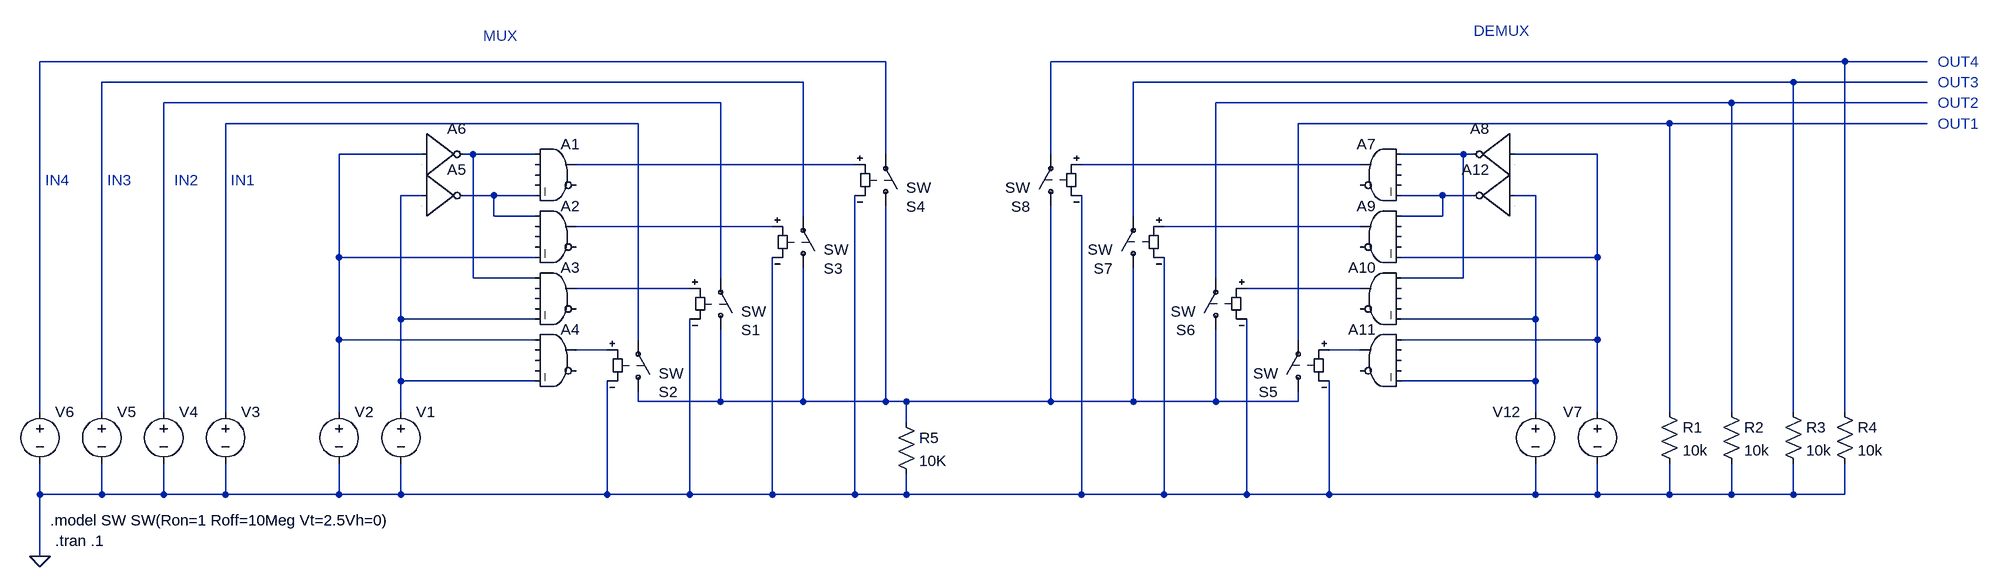
[diagram p0: schematic Mux-demux2.asc]
Mux-demux2.asc, the LTspice schematic file:
Version 4
SHEET 1 1648 1716
WIRE -224 768 -1536 768
WIRE 1264 768 32 768
WIRE 1392 768 1264 768
WIRE -352 800 -1440 800
WIRE 1184 800 160 800
WIRE 1392 800 1184 800
WIRE -480 832 -1344 832
WIRE 1088 832 288 832
WIRE 1392 832 1088 832
WIRE -608 864 -1248 864
WIRE 992 864 416 864
WIRE 1392 864 992 864
WIRE -944 912 -1072 912
WIRE -864 912 -880 912
WIRE -768 912 -864 912
WIRE -224 912 -224 768
WIRE 32 912 32 768
WIRE 672 912 576 912
WIRE 688 912 672 912
WIRE 880 912 752 912
WIRE -272 928 -704 928
WIRE 512 928 80 928
WIRE -944 976 -976 976
WIRE -832 976 -880 976
WIRE -768 976 -832 976
WIRE 640 976 576 976
WIRE 688 976 640 976
WIRE 784 976 752 976
WIRE -832 1008 -832 976
WIRE -768 1008 -832 1008
WIRE -352 1008 -352 800
WIRE 160 1008 160 800
WIRE 640 1008 640 976
WIRE 640 1008 576 1008
WIRE -400 1024 -704 1024
WIRE 512 1024 208 1024
WIRE -1072 1072 -1072 912
WIRE -768 1072 -1072 1072
WIRE 880 1072 880 912
WIRE 880 1072 576 1072
WIRE -864 1104 -864 912
WIRE -768 1104 -864 1104
WIRE -480 1104 -480 832
WIRE 288 1104 288 832
WIRE 672 1104 672 912
WIRE 672 1104 576 1104
WIRE -528 1120 -704 1120
WIRE 512 1120 336 1120
WIRE -976 1168 -976 976
WIRE -768 1168 -976 1168
WIRE 784 1168 784 976
WIRE 784 1168 576 1168
WIRE -1072 1200 -1072 1072
WIRE -768 1200 -1072 1200
WIRE -608 1200 -608 864
WIRE 416 1200 416 864
WIRE 880 1200 880 1072
WIRE 880 1200 576 1200
WIRE -656 1216 -704 1216
WIRE 512 1216 464 1216
WIRE -976 1264 -976 1168
WIRE -768 1264 -976 1264
WIRE 784 1264 784 1168
WIRE 784 1264 576 1264
WIRE -608 1296 -608 1280
WIRE -480 1296 -480 1184
WIRE -480 1296 -608 1296
WIRE -352 1296 -352 1088
WIRE -352 1296 -480 1296
WIRE -224 1296 -224 992
WIRE -224 1296 -352 1296
WIRE -192 1296 -224 1296
WIRE 32 1296 32 992
WIRE 32 1296 -192 1296
WIRE 160 1296 160 1088
WIRE 160 1296 32 1296
WIRE 288 1296 288 1184
WIRE 288 1296 160 1296
WIRE 416 1296 416 1280
WIRE 416 1296 288 1296
WIRE -1536 1312 -1536 768
WIRE -1440 1312 -1440 800
WIRE -1344 1312 -1344 832
WIRE -1248 1312 -1248 864
WIRE -1072 1312 -1072 1200
WIRE -976 1312 -976 1264
WIRE 784 1312 784 1264
WIRE 880 1312 880 1200
WIRE 992 1312 992 864
WIRE 1088 1312 1088 832
WIRE 1184 1312 1184 800
WIRE 1264 1312 1264 768
WIRE -192 1328 -192 1296
WIRE -1536 1440 -1536 1392
WIRE -1440 1440 -1440 1392
WIRE -1440 1440 -1536 1440
WIRE -1344 1440 -1344 1392
WIRE -1344 1440 -1440 1440
WIRE -1248 1440 -1248 1392
WIRE -1248 1440 -1344 1440
WIRE -1072 1440 -1072 1392
WIRE -1072 1440 -1248 1440
WIRE -976 1440 -976 1392
WIRE -976 1440 -1072 1440
WIRE -656 1440 -656 1264
WIRE -656 1440 -976 1440
WIRE -528 1440 -528 1168
WIRE -528 1440 -656 1440
WIRE -400 1440 -400 1072
WIRE -400 1440 -528 1440
WIRE -272 1440 -272 976
WIRE -272 1440 -400 1440
WIRE -192 1440 -192 1408
WIRE -192 1440 -272 1440
WIRE 80 1440 80 976
WIRE 80 1440 -192 1440
WIRE 208 1440 208 1072
WIRE 208 1440 80 1440
WIRE 336 1440 336 1168
WIRE 336 1440 208 1440
WIRE 464 1440 464 1264
WIRE 464 1440 336 1440
WIRE 784 1440 784 1392
WIRE 784 1440 464 1440
WIRE 880 1440 880 1392
WIRE 880 1440 784 1440
WIRE 992 1440 992 1392
WIRE 992 1440 880 1440
WIRE 1088 1440 1088 1392
WIRE 1088 1440 992 1440
WIRE 1184 1440 1184 1392
WIRE 1184 1440 1088 1440
WIRE 1264 1440 1264 1392
WIRE 1264 1440 1184 1440
WIRE -1536 1536 -1536 1440
FLAG -1536 1536 0
SYMBOL Digital\\and -736 880 R0
WINDOW 3 16 52 Invisible 0
SYMATTR Value vhigh 5V trise 1e-6 tfall 1e-6
SYMATTR InstName A1
SYMBOL Digital\\inv -944 848 R0
WINDOW 3 8 60 Invisible 0
SYMATTR Value vhigh 5V trise 1e-6 tfall 1e-6
SYMATTR InstName A6
SYMBOL sw -608 1296 M180
WINDOW 0 32 15 Left 0
WINDOW 3 32 44 Left 0
SYMATTR InstName S2
SYMBOL sw -480 1200 M180
WINDOW 0 32 15 Left 0
WINDOW 3 32 44 Left 0
SYMATTR InstName S1
SYMBOL sw -352 1104 M180
WINDOW 0 32 15 Left 0
WINDOW 3 32 44 Left 0
SYMATTR InstName S3
SYMBOL sw -224 1008 M180
WINDOW 0 32 15 Left 0
WINDOW 3 32 44 Left 0
SYMATTR InstName S4
SYMBOL voltage -1072 1296 R0
WINDOW 3 24 104 Invisible 0
WINDOW 123 0 0 Left 0
WINDOW 39 0 0 Left 0
SYMATTR Value PULSE(0 5 0 1e-7 1e-7 1e-2 2e-2)
SYMATTR InstName V2
SYMBOL voltage -1248 1296 R0
WINDOW 3 24 104 Invisible 0
WINDOW 123 0 0 Left 0
WINDOW 39 0 0 Left 0
SYMATTR Value SINE(0 1 4000)
SYMATTR InstName V3
SYMBOL voltage -1344 1296 R0
WINDOW 3 24 104 Invisible 0
WINDOW 123 0 0 Left 0
WINDOW 39 0 0 Left 0
SYMATTR Value SINE(0 1 3000)
SYMATTR InstName V4
SYMBOL voltage -1440 1296 R0
WINDOW 3 24 104 Invisible 0
WINDOW 123 0 0 Left 0
WINDOW 39 0 0 Left 0
SYMATTR Value SINE(0 1 2000)
SYMATTR InstName V5
SYMBOL voltage -1536 1296 R0
WINDOW 3 24 104 Invisible 0
WINDOW 123 0 0 Left 0
WINDOW 39 0 0 Left 0
SYMATTR Value SINE(0 1 1000)
SYMATTR InstName V6
SYMBOL Digital\\and -736 976 R0
WINDOW 3 16 52 Invisible 0
SYMATTR Value vhigh 5V trise 1e-6 tfall 1e-6
SYMATTR InstName A2
SYMBOL Digital\\and -736 1072 R0
WINDOW 3 16 52 Invisible 0
SYMATTR Value vhigh 5V trise 1e-6 tfall 1e-6
SYMATTR InstName A3
SYMBOL Digital\\and -736 1168 R0
WINDOW 3 16 52 Invisible 0
SYMATTR Value vhigh 5V trise 1e-6 tfall 1e-6
SYMATTR InstName A4
SYMBOL Digital\\inv -944 912 R0
WINDOW 3 8 60 Invisible 0
SYMATTR Value vhigh 5V trise 1e-6 tfall 1e-6
SYMATTR InstName A5
SYMBOL voltage -976 1296 R0
WINDOW 3 24 104 Invisible 0
WINDOW 123 0 0 Left 0
WINDOW 39 0 0 Left 0
SYMATTR Value PULSE(0 5 0 1e-7 1e-7 2e-2 4e-2)
SYMATTR InstName V1
SYMBOL Digital\\and 544 880 M0
WINDOW 3 16 52 Invisible 0
SYMATTR Value vhigh 5V trise 1e-6 tfall 1e-6
SYMATTR InstName A7
SYMBOL Digital\\inv 752 848 M0
WINDOW 3 8 60 Invisible 0
SYMATTR Value vhigh 5V trise 1e-6 tfall 1e-6
SYMATTR InstName A8
SYMBOL sw 416 1296 R180
WINDOW 0 32 15 Left 0
WINDOW 3 32 44 Left 0
SYMATTR InstName S5
SYMBOL sw 288 1200 R180
WINDOW 0 32 15 Left 0
WINDOW 3 32 44 Left 0
SYMATTR InstName S6
SYMBOL sw 160 1104 R180
WINDOW 0 32 15 Left 0
WINDOW 3 32 44 Left 0
SYMATTR InstName S7
SYMBOL sw 32 1008 R180
WINDOW 0 32 15 Left 0
WINDOW 3 32 44 Left 0
SYMATTR InstName S8
SYMBOL voltage 880 1296 M0
WINDOW 3 24 104 Invisible 0
WINDOW 123 0 0 Left 0
WINDOW 39 0 0 Left 0
SYMATTR Value PULSE(0 5 0 1e-7 1e-7 1e-2 2e-2)
SYMATTR InstName V7
SYMBOL Digital\\and 544 976 M0
WINDOW 3 16 52 Invisible 0
SYMATTR Value vhigh 5V trise 1e-6 tfall 1e-6
SYMATTR InstName A9
SYMBOL Digital\\and 544 1072 M0
WINDOW 3 16 52 Invisible 0
SYMATTR Value vhigh 5V trise 1e-6 tfall 1e-6
SYMATTR InstName A10
SYMBOL Digital\\and 544 1168 M0
WINDOW 3 16 52 Invisible 0
SYMATTR Value vhigh 5V trise 1e-6 tfall 1e-6
SYMATTR InstName A11
SYMBOL Digital\\inv 752 912 M0
WINDOW 3 8 60 Invisible 0
SYMATTR Value vhigh 5V trise 1e-6 tfall 1e-6
SYMATTR InstName A12
SYMBOL voltage 784 1296 M0
WINDOW 3 24 104 Invisible 0
WINDOW 123 0 0 Left 0
WINDOW 39 0 0 Left 0
SYMATTR Value PULSE(0 5 0 1e-7 1e-7 2e-2 4e-2)
SYMATTR InstName V12
SYMBOL res 976 1296 R0
SYMATTR InstName R1
SYMATTR Value 10k
SYMBOL res 1072 1296 R0
SYMATTR InstName R2
SYMATTR Value 10k
SYMBOL res 1168 1296 R0
SYMATTR InstName R3
SYMATTR Value 10k
SYMBOL res 1248 1296 R0
SYMATTR InstName R4
SYMATTR Value 10k
SYMBOL res -208 1312 R0
SYMATTR InstName R5
SYMATTR Value 10K
TEXT -1520 1480 Left 0 !.model SW SW(Ron=1 Roff=10Meg Vt=2.5Vh=0)
TEXT -1512 1512 Left 0 !.tran .1
TEXT 1408 864 Left 0 ;OUT1
TEXT 1408 832 Left 0 ;OUT2
TEXT 1408 800 Left 0 ;OUT3
TEXT 1408 768 Left 0 ;OUT4
TEXT -848 728 Left 0 ;MUX
TEXT 688 720 Left 0 ;DEMUX
TEXT -1240 952 Left 0 ;IN1
TEXT -1328 952 Left 0 ;IN2
TEXT -1432 952 Left 0 ;IN3
TEXT -1528 952 Left 0 ;IN4

The netlist it stands for:
* Mux-demux2.asc
A1 N010 0 0 0 N016 0 N013 0 AND vhigh 5V trise 1e-6 tfall 1e-6
A6 N009 0 0 0 0 N010 0 0 BUF vhigh 5V trise 1e-6 tfall 1e-6
S2 N025 N007 N023 0 SW
S1 N025 N005 N021 0 SW
S3 N025 N003 N019 0 SW
S4 N025 N001 N013 0 SW
V2 N009 0 PULSE(0 5 0 1e-7 1e-7 1e-2 2e-2)
V3 N007 0 SINE(0 1 4000)
V4 N005 0 SINE(0 1 3000)
V5 N003 0 SINE(0 1 2000)
V6 N001 0 SINE(0 1 1000)
A2 N016 0 0 0 N009 0 N019 0 AND vhigh 5V trise 1e-6 tfall 1e-6
A3 N010 0 0 0 N015 0 N021 0 AND vhigh 5V trise 1e-6 tfall 1e-6
A4 N009 0 0 0 N015 0 N023 0 AND vhigh 5V trise 1e-6 tfall 1e-6
A5 N015 0 0 0 0 N016 0 0 BUF vhigh 5V trise 1e-6 tfall 1e-6
V1 N015 0 PULSE(0 5 0 1e-7 1e-7 2e-2 4e-2)
A7 N011 0 0 0 N017 0 N014 0 AND vhigh 5V trise 1e-6 tfall 1e-6
A8 N012 0 0 0 0 N011 0 0 BUF vhigh 5V trise 1e-6 tfall 1e-6
S5 N025 N008 N024 0 SW
S6 N025 N006 N022 0 SW
S7 N025 N004 N020 0 SW
S8 N025 N002 N014 0 SW
V7 N012 0 PULSE(0 5 0 1e-7 1e-7 1e-2 2e-2)
A9 N017 0 0 0 N012 0 N020 0 AND vhigh 5V trise 1e-6 tfall 1e-6
A10 N011 0 0 0 N018 0 N022 0 AND vhigh 5V trise 1e-6 tfall 1e-6
A11 N012 0 0 0 N018 0 N024 0 AND vhigh 5V trise 1e-6 tfall 1e-6
A12 N018 0 0 0 0 N017 0 0 BUF vhigh 5V trise 1e-6 tfall 1e-6
V12 N018 0 PULSE(0 5 0 1e-7 1e-7 2e-2 4e-2)
R1 N008 0 10k
R2 N006 0 10k
R3 N004 0 10k
R4 N002 0 10k
R5 N025 0 10K
.model SW SW(Ron=1 Roff=10Meg Vt=2.5Vh=0)
.tran .1
* OUT1
* OUT2
* OUT3
* OUT4
* MUX
* DEMUX
* IN1
* IN2
* IN3
* IN4
.backanno
.end